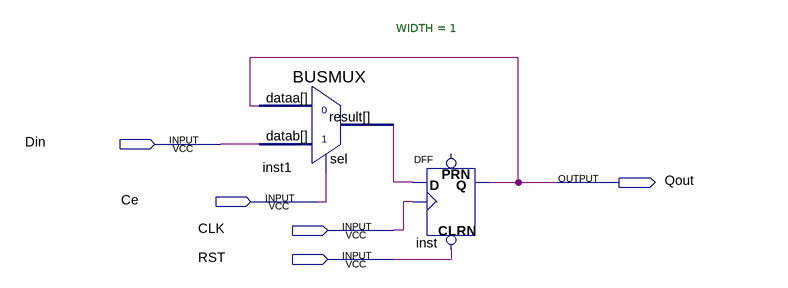
[diagram p0: schematic sheet]
// Quartus schematic FDRE.bdf as structural Verilog: 2 symbols, 5 pins
module FDRE (
  input  Din,
  input  Ce,
  input  CLK,
  input  RST,
  output Qout
);

  wire inst1_result;

  BUSMUX #(.WIDTH(1)) inst1 (.datab(Din), .sel(Ce), .dataa(Qout), .result(inst1_result));
  DFF inst (.CLRN(RST), .CLK(CLK), .D(inst1_result), .Q(Qout));  // open: PRN
endmodule
